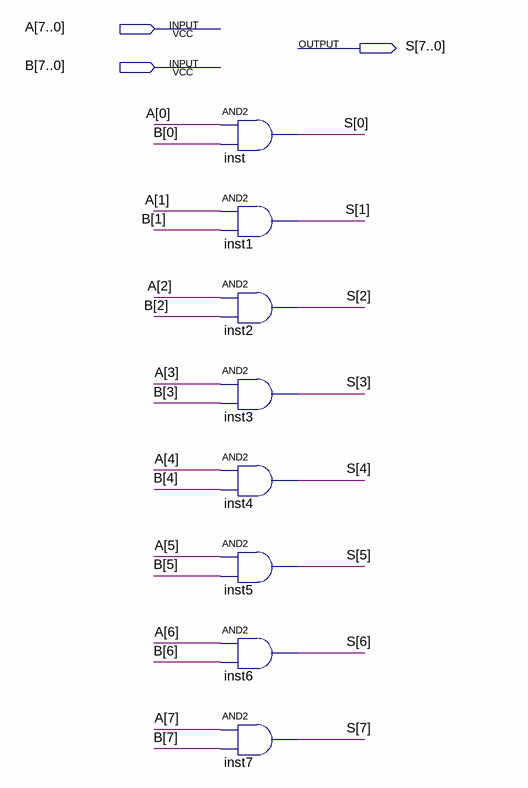
[diagram p0: schematic sheet]
// Quartus schematic AND_8_BITS.bdf as structural Verilog: 8 symbols, 3 pins
module AND_8_BITS (
  input  [7:0] A,
  input  [7:0] B,
  output [7:0] S
);

  and inst (S[0], A[0], B[0]);
  and inst1 (S[1], A[1], B[1]);
  and inst2 (S[2], A[2], B[2]);
  and inst3 (S[3], A[3], B[3]);
  and inst4 (S[4], A[4], B[4]);
  and inst5 (S[5], A[5], B[5]);
  and inst6 (S[6], A[6], B[6]);
  and inst7 (S[7], A[7], B[7]);
endmodule
